# Altium project INDOORVOC.PrjPcb
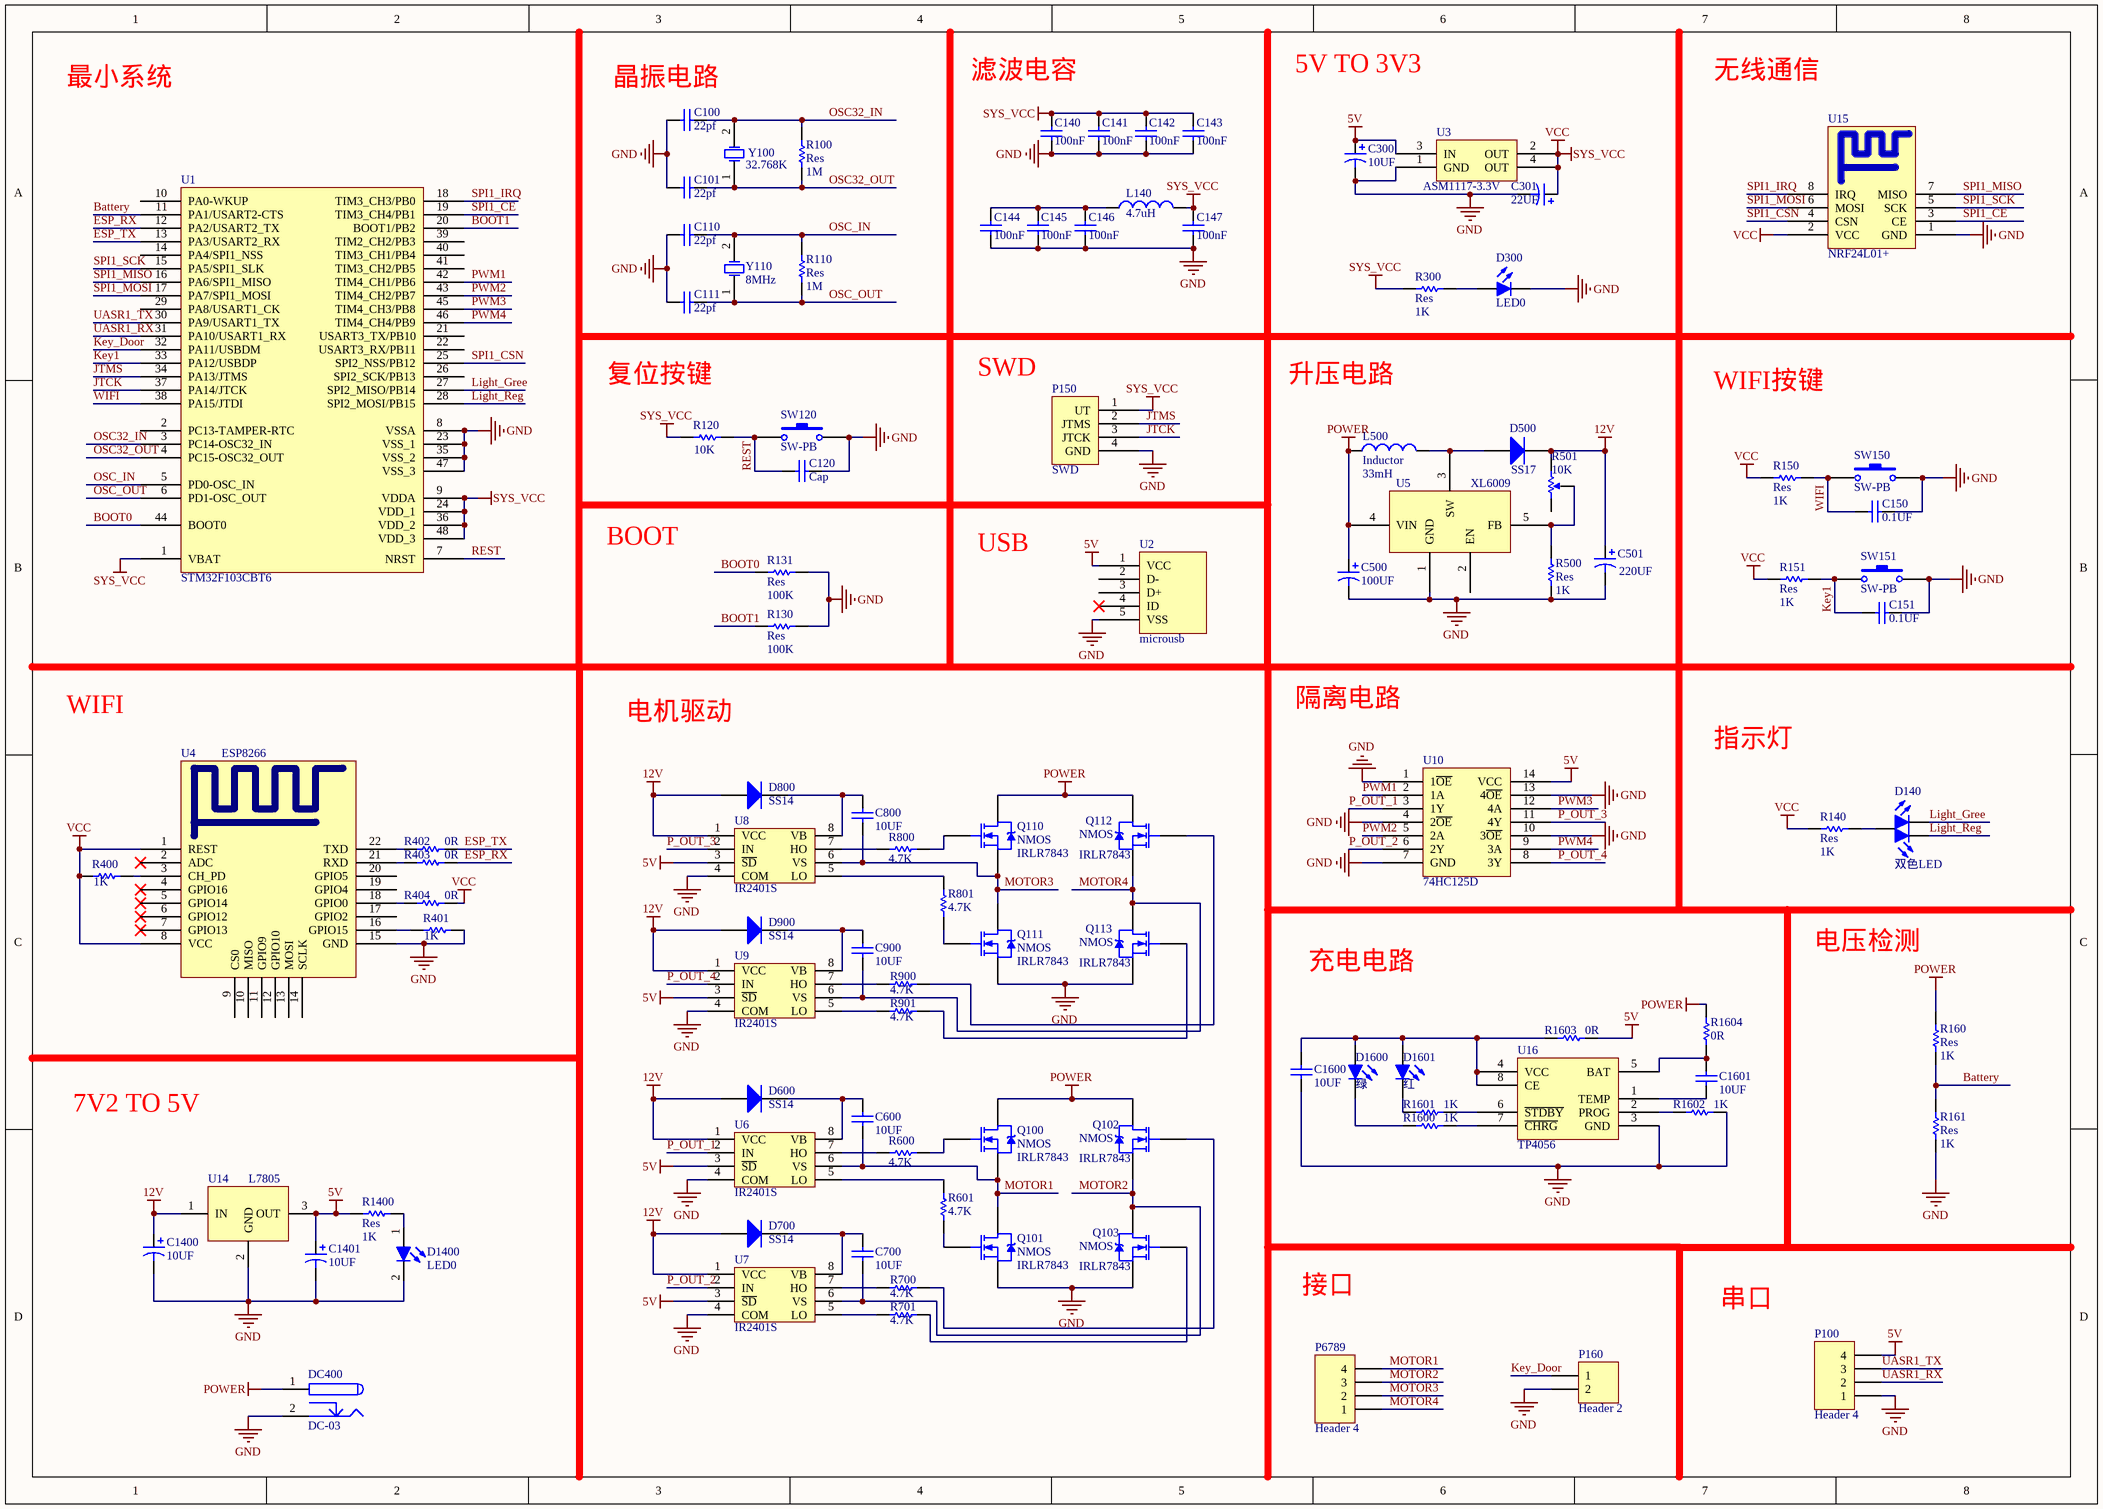
[diagram p0: Baseplate.SchDoc]
1 sheet, 102 parts. Net scope: global (net labels, ports and power ports of the same name join across sheets).
Board file: Baseplate.PcbDoc

## Sheet Baseplate.SchDoc
size A3

### Parts
C100  22pf  [0805]
C101  22pf  [0805]
C110  22pf  [0805]
C111  22pf  [0805]
C120  Cap  [0805]
C140  100nF  [0805]
C141  100nF  [0805]
C142  100nF  [0805]
C143  100nF  [0805]
C144  100nF  [0805]
C145  100nF  [0805]
C146  100nF  [0805]
C147  100nF  [0805]
C150  0.1UF  [Cap0805]
C151  0.1UF  [Cap0805]
C300  10UF  [Cap0805]
C301  22UF  [Cap0805]
C500  100UF  [SMD6.3*7.7]
C501  Vaule: 220UF  [SMD8*10.5]  (hidden comment: Cap Pol5)
C600  10UF  [0805]
C700  10UF  [0805]
C800  10UF  [0805]
C900  10UF  [0805]
C1400  10UF  [SMD4*4.5]
C1401  10UF  [SMD4*4.5]
C1600  10UF  [Cap0805]
C1601  10UF  [Cap0805]
D140  双色LED  [双色LED]
D300  LED0  [LED-0805]
D500  SS17  [DO-214AA]
D600  SS14  [DO-214AA]
D700  SS14  [DO-214AA]
D800  SS14  [DO-214AA]
D900  SS14  [DO-214AA]
D1400  LED0  [LED-0805]
D1600  绿  [LED-0805]
D1601  红  [LED-0805]
DC400  DC-03  [DC-003]
L140  value 4.7uH  [0805]  (hidden comment: Inductor)
L500  Inductor  value 33mH  [68uH-7*7]
P100  Header 4  [HDR1X4]
P150  SWD  [XH2.54-4P]
P160  Header 2  [HDR1X2]
P6789  Header 4  [XH2.54-4P]
Q100  NMOS  Vaule: IRLR7843  [DPAK/TO-252AA]
Q101  NMOS  Vaule: IRLR7843  [DPAK/TO-252AA]
Q102  NMOS  Vaule: IRLR7843  [DPAK/TO-252AA]
Q103  NMOS  Vaule: IRLR7843  [DPAK/TO-252AA]
Q110  NMOS  Vaule: IRLR7843  [DPAK/TO-252AA]
Q111  NMOS  Vaule: IRLR7843  [DPAK/TO-252AA]
Q112  NMOS  Vaule: IRLR7843  [DPAK/TO-252AA]
Q113  NMOS  Vaule: IRLR7843  [DPAK/TO-252AA]
R100  Res  [0805]
R110  Res  [0805]
R120  Res  [0805]  (value not drawn)
R130  Res  [0805]
R131  Res  [0805]
R140  Res  Vaule: 1K  [0805]
R150  Res  Vaule: 1K  [0805]
R151  Res  Vaule: 1K  [0805]
R160  Res  Vaule: 1K  [0805]
R161  Res  Vaule: 1K  [0805]
R300  Res  [0805]
R400  Vaule: 1K  [0805]  (hidden comment: Res)
R401  Vaule: 1K  [0805]  (hidden comment: Res)
R402  Vaule: 0R  [0805]  (hidden comment: Res)
R403  Vaule: 0R  [0805]  (hidden comment: Res)
R404  Vaule: 0R  [0805]  (hidden comment: Res)
R500  Res  [0805]
R501  10K  [3296W]
R600  (no value)  [0805]
R601  (no value)  [0805]
R700  (no value)  [0805]
R701  (no value)  [0805]
R800  (no value)  [0805]
R801  (no value)  [0805]
R900  (no value)  [0805]
R901  (no value)  [0805]
R1400  Res  [0805]
R1600  Vaule: 1K  [0805]  (hidden comment: Res)
R1601  Vaule: 1K  [0805]  (hidden comment: Res)
R1602  Vaule: 1K  [0805]  (hidden comment: Res)
R1603  Vaule: 0R  [0805]  (hidden comment: Res)
R1604  Vaule: 0R  [0805]  (hidden comment: Res)
SW120  SW-PB  [SW-PB]
SW150  SW-PB  [SW-PB]
SW151  SW-PB  [SW-PB]
U1  STM32F103CBT6  [LQFP-48]
U2  microusb  [microusb]
U3  ASM1117-3.3V  [SOT-223]
U4  ESP8266  [ESP8266]
U5  XL6009  [TO-263-5]
U6  IR2401S  [SOP8]
U7  IR2401S  [SOP8]
U8  IR2401S  [SOP8]
U9  IR2401S  [SOP8]
U10  74HC125D  [SOP14]
U14  L7805  [TO-220-3]
U15  NRF24L01+  [DIP8NRF]
U16  TP4056  [SOP8]
Y100  32.768K  [308晶振]
Y110  8MHz  [X-HC49U]

### Nets
5V: C300.1 C1401.1 P100.4 R1400.2 R1603.2 U2.1(VCC) U3.3(IN) U6.3(~{SD}) U7.3(~{SD}) U8.3(~{SD}) U9.3(~{SD}) U10.14(VCC) U14.3(OUT)
12V: C501.1 C1400.1 D500.2(K) D600.1(A) D700.1(A) D800.1(A) D900.1(A) R501.1 U6.1(VCC) U7.1(VCC) U8.1(VCC) U9.1(VCC) U14.1(IN)
GND: C100.1 C101.1 C110.1 C111.1 C120.2 C140.1 C141.1 C142.1 C143.1 C144.1 C145.1 C146.1 C147.1 C150.2 C151.2 C300.2 C301.2 C500.2 C501.2 C1400.2 C1401.2 C1600.1 D300.2(K) D1400.2(K) DC400.2 P100.1 P150.4(GND) P160.2 Q101.3(S) Q103.3(S) Q111.3(S) Q113.3(S) R130.1 R131.2 R161.1 R401.2 R500.1 R1602.2 SW120.2 SW150.2 SW151.2 U1.8(VSSA) U1.23(VSS_1) U1.35(VSS_2) U1.47(VSS_3) U2.5(VSS) U3.1(GND) U4.15(GND) U5.1(GND) U6.4(COM) U7.4(COM) U8.4(COM) U9.4(COM) U10.1(1~{OE}) U10.4(2~{OE}) U10.7(GND) U10.10(3~{OE}) U10.13(4~{OE}) U14.2(GND) U15.1(GND) U16.3(GND)
POWER: C500.1 DC400.1 L500.1 Q100.2(D) Q102.2(D) Q110.2(D) Q112.2(D) R160.2 R1604.2 U5.4(VIN)
SYS_VCC: C140.2 C141.2 C142.2 C143.2 C147.2 C301.1 L140.2 P150.1(UT) R120.1 R140.1 R150.1 R151.1 R300.1 R400.1 R404.2 U1.1(VBAT) U1.9(VDDA) U1.24(VDD_1) U1.36(VDD_2) U1.48(VDD_3) U3.2(OUT) U3.4(OUT) U4.1(REST) U4.8(VCC) U15.2(VCC)  [also labelled VCC]
Battery: R160.1 R161.2 U1.11(PA1/USART2-CTS)
BOOT0: R131.1 U1.44(BOOT0)
BOOT1: R130.2 U1.20(BOOT1/PB2)
ESP_RX: R403.2 U1.12(PA2/USART2_TX)
ESP_TX: R402.2 U1.13(PA3/USART2_RX)
JTCK: P150.3(JTCK) U1.37(PA14/JTCK)
JTMS: P150.2(JTMS) U1.34(PA13/JTMS)
Key1: C151.1 R151.2 SW151.1 U1.33(PA12/USBDP)
Key_Door: P160.1 U1.32(PA11/USBDM)
Light_Gree: D140.1(A) U1.27(SPI2_MISO/PB14)
Light_Reg: D140.3(A) U1.28(SPI2_MOSI/PB15)
MOTOR1: C600.2 P6789.4 Q100.3(S) Q101.2(D) U6.6(VS)
MOTOR2: C700.2 P6789.3 Q102.3(S) Q103.2(D) U7.6(VS)
MOTOR3: C800.2 P6789.2 Q110.3(S) Q111.2(D) U8.6(VS)
MOTOR4: C900.2 P6789.1 Q112.3(S) Q113.2(D) U9.6(VS)
OSC32_IN: C100.2 R100.2 U1.3(PC14-OSC32_IN) Y100.2(OSC2)
OSC32_OUT: C101.2 R100.1 U1.4(PC15-OSC32_OUT) Y100.1(OSC1)
OSC_IN: C110.2 R110.2 U1.5(PD0-OSC_IN) Y110.2(OSC2)
OSC_OUT: C111.2 R110.1 U1.6(PD1-OSC_OUT) Y110.1(OSC1)
P_OUT_1: U6.2(IN) U10.3(1Y)
P_OUT_2: U7.2(IN) U10.6(2Y)
P_OUT_3: U8.2(IN) U10.11(4Y)
P_OUT_4: U9.2(IN) U10.8(3Y)
PWM1: U1.42(TIM4_CH1/PB6) U10.2(1A)
PWM2: U1.43(TIM4_CH2/PB7) U10.5(2A)
PWM3: U1.45(TIM4_CH3/PB8) U10.12(4A)
PWM4: U1.46(TIM4_CH4/PB9) U10.9(3A)
REST: C120.1 R120.2 SW120.1 U1.7(NRST)
SPI1_CE: U1.19(TIM3_CH4/PB1) U15.3(CE)
SPI1_CSN: U1.25(SPI2_NSS/PB12) U15.4(CSN)
SPI1_IRQ: U1.18(TIM3_CH3/PB0) U15.8(IRQ)
SPI1_MISO: U1.16(PA6/SPI1_MISO) U15.7(MISO)
SPI1_MOSI: U1.17(PA7/SPI1_MOSI) U15.6(MOSI)
SPI1_SCK: U1.15(PA5/SPI1_SLK) U15.5(SCK)
UASR1_RX: P100.2 U1.31(PA10/USART1_RX)
UASR1_TX: P100.3 U1.30(PA9/USART1_TX)
WIFI: C150.1 R150.2 SW150.1 U1.38(PA15/JTDI)
NetC144_2: C144.2 C145.2 C146.2 L140.1
NetC600_1: C600.1 D600.2(K) U6.8(VB)
NetC700_1: C700.1 D700.2(K) U7.8(VB)
NetC800_1: C800.1 D800.2(K) U8.8(VB)
NetC900_1: C900.1 D900.2(K) U9.8(VB)
NetC1600_2: C1600.2 D1600.1(A) D1601.1(A) R1603.1 U16.4(VCC) U16.8(CE)
NetC1601_1: C1601.1 U16.1(TEMP)
NetC1601_2: C1601.2 R1604.1 U16.5(BAT)
NetD140_2: D140.2(K) R140.2
NetD300_1: D300.1(A) R300.2
NetD500_1: D500.1(A) L500.2 U5.3(SW)
NetD1400_1: D1400.1(A) R1400.1
NetD1600_2: D1600.2(K) R1600.1
NetD1601_2: D1601.2(K) R1601.1
NetQ100_1: Q100.1(G) R600.1
NetQ101_1: Q101.1(G) R601.1
NetQ102_1: Q102.1(G) R700.1
NetQ103_1: Q103.1(G) R701.1
NetQ110_1: Q110.1(G) R800.1
NetQ111_1: Q111.1(G) R801.1
NetQ112_1: Q112.1(G) R900.1
NetQ113_1: Q113.1(G) R901.1
NetR400_2: R400.2 U4.3(CH_PD)
NetR401_1: R401.1 U4.16(GPIO15)
NetR402_1: R402.1 U4.22(TXD)
NetR403_1: R403.1 U4.21(RXD)
NetR404_1: R404.1 U4.18(GPIO0)
NetR500_2: R500.2 R501.2 U5.5(FB)
NetR600_2: R600.2 U6.7(HO)
NetR601_2: R601.2 U6.5(LO)
NetR700_2: R700.2 U7.7(HO)
NetR701_2: R701.2 U7.5(LO)
NetR800_2: R800.2 U8.7(HO)
NetR801_2: R801.2 U8.5(LO)
NetR900_2: R900.2 U9.7(HO)
NetR901_2: R901.2 U9.5(LO)
NetR1600_2: R1600.2 U16.7(~{CHRG})
NetR1601_2: R1601.2 U16.6(~{STDBY})
NetR1602_1: R1602.1 U16.2(PROG)

Not connected (* = marked no-connect by the designer): R501 3; U1 2(PC13-TAMPER-RTC) 10(PA0-WKUP) 14(PA4/SPI1_NSS) 21(USART3_TX/PB10) 22(USART3_RX/PB11) 26(SPI2_SCK/PB13) 29(PA8/USART1_CK) 39(TIM2_CH2/PB3) 40(TIM3_CH1/PB4) 41(TIM3_CH2/PB5); U2 2(D-) 3(D+) 4(ID)*; U4 2(ADC)* 4(GPIO16)* 5(GPIO14)* 6(GPIO12)* 7(GPIO13)* 9(CS0) 10(MISO) 11(GPIO9) 12(GPIO10) 13(MOSI) 14(SCLK) 17(GPIO2) 19(GPIO4) 20(GPIO5); U5 2(EN)

### Notes on the sheet
- 最小系统
- (near C100) 晶振电路
- (near C140) 滤波电容
- 5V TO 3V3
- 无线通信
- SWD
- 复位按键
- 升压电路
- WIFI按键
- BOOT
- USB
- WIFI
- 电机驱动
- 隔离电路
- 指示灯
- 充电电路
- 电压检测
- 7V2 TO 5V
- 接口
- 串口
- (in symbol Res) 1M; 10K; 100K; 1K; 4.7K

### Library data of the parts
C100 C101 C110 C111 C120 C140-C147 C150 C151 C600 C700 C800 C900 C1600 C1601 = Cap: 0805贴片电容
C300 = Cap Pol3: 10UF钽电容
C301 = Cap Pol2: 22UF钽电容
C500 = Cap Pol4: 100UF电解电容
C501 = Cap Pol5: 220UF电解电容
C1400 C1401 = Cap Pol4: 10UF钽电容
D140 = 双色LED: 直插双色LED灯
D300 D1400 D1600 D1601 = LED0: 0805贴片LED灯
D500 = Diode 1N4007: 1 Amp General Purpose Rectifier; Published: 8-Jun-2000; LatestRevisionDate: 17-Jul-2002; LatestRevisionNote: Re-released for DXP Platform.; DatasheetVersion: 1998; PackageVersion: Aug-1999; PackageReference: DO-41; Publisher: Altium Limited; PackageDescription: Diode, Axial; Body 5.2 x 2.7 mm (LxDia. max), Lead Dia. 0.86 mm (max); Code_JEDEC: DO-204-AL; ComponentLink1Description: Manufacturer Link; ComponentLink1URL: http://www.fairchildsemi.com/; ComponentLink2Description: Datasheet; ComponentLink2URL: http://www.fairchildsemi.com/ds/1N%2F1N4001.pdf
D600 D700 D800 D900 = Doide: 肖特基二极管
DC400 = DC-05: DC电源端子
L140 L500 = Inductor: Code_IEC: 1005; Published: 8-Jun-2000; LatestRevisionDate: 29-May-2009; LatestRevisionNote: IPC-7351 Footprint Added.; PackageReference: 0402-A; Publisher: Altium Limited; PackageDescription: Chip Inductor; Code_JEITA: 0402
P100 P6789 = Header 4: Header, 4-Pin; LatestRevisionDate: 17-Jul-2002; LatestRevisionNote: Re-released for DXP Platform.; Publisher: Altium Limited
P150 = SWD: SWD下载端口
P160 = Header 2: Header, 2-Pin; LatestRevisionDate: 17-Jul-2002; LatestRevisionNote: Re-released for DXP Platform.; Publisher: Altium Limited
Q100-Q103 Q110-Q113 = NMOS: N沟MOS管
R140 R150 R151 R160 R161 R400-R404 R1600-R1604 = Res: 0805贴片电阻
R501 = ResAdj: 3362电阻
R600 R601 R700 R701 R800 R801 R900 R901 = Res
SW120 SW150 SW151 = SW-PB: 贴片按键
U1 = STM32F103C8T6: Cortex-M3内核单片机
U3 = ASM1117: 线性稳压芯片
U4 = ESP8266: 串口wifi模块
U5 = XL6009: 升压芯片
U6-U9 = IR2401S: 半桥驱动器; Vaule: IR2401S
U14 = L7805: 5V线性稳压芯片
U15 = NRF24L01+: 直插式NRF
U16 = TP4056: 锂电池充电芯片
Y110 = XTAL: 无源晶振